# Altium schematic sheet can-interface.SchDoc
size A
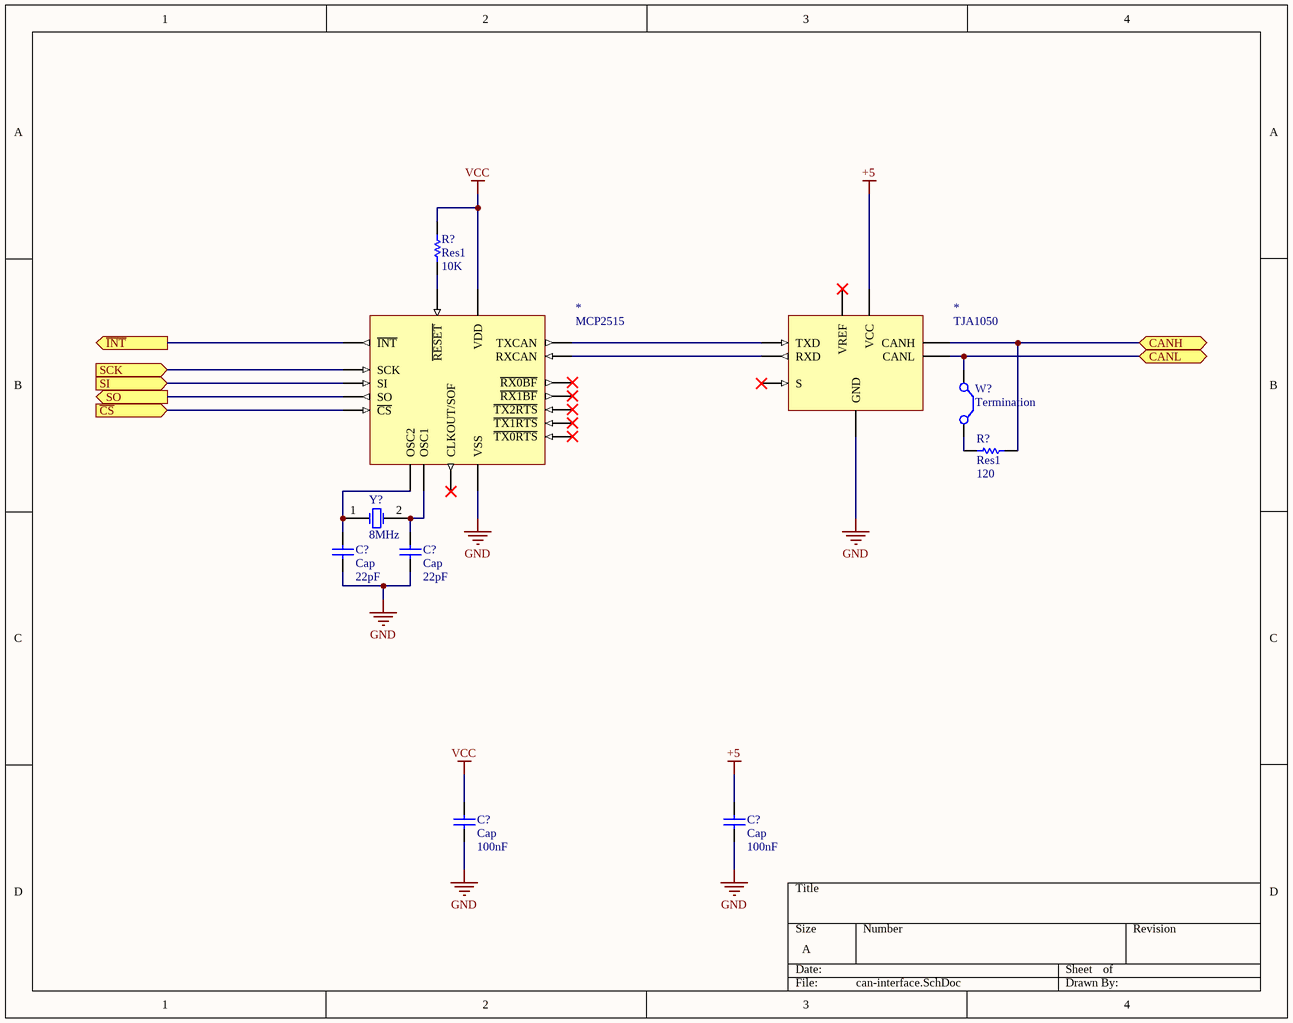
[diagram p0: can-interface.SchDoc]

## Parts
(Parts that share a designator on the sheet are numbered #1, #2 ... from top to bottom, then left to right.)
*#1  MCP2515
*#2  TJA1050
C?#1  Cap  value 22pF  [RAD-0.3]
C?#2  Cap  value 22pF  [RAD-0.3]
C?#3  Cap  value 100nF  [RAD-0.3]
C?#4  Cap  value 100nF  [RAD-0.3]
R?#1  Res1  value 10K  [AXIAL-0.3]
R?#2  Res1  value 120  [AXIAL-0.3]
W?  Termination  [RAD-0.2]
Y?  8MHz  [R38]

## Ports
CANH (bidir), CANL (bidir), SCK (in), SI (in), SO (out), ~{CS} (in), ~{INT} (out)

## Nets
+5: *#2.3(VCC) C?#4.2
GND: *#1.9(VSS) *#2.2(GND) C?#1.1 C?#2.1 C?#3.1 C?#4.1
VCC: *#1.18(VDD) C?#3.2 R?#1.2
~{CS}: *#1.16(~{CS}) ; port ~{CS}
CANH: *#2.7(CANH) R?#2.2 ; port CANH
CANL: *#2.6(CANL) W?.1(C1) ; port CANL
~{INT}: *#1.12(~{INT}) ; port ~{INT}
SCK: *#1.13(SCK) ; port SCK
SI: *#1.14(SI) ; port SI
SO: *#1.15(SO) ; port SO
Net*#1_1: *#1.1(TXCAN) *#2.1(TXD)
Net*#1_2: *#1.2(RXCAN) *#2.4(RXD)
Net*#1_7: *#1.7(OSC2) C?#1.2 Y?.1(OSC1)
Net*#1_8: *#1.8(OSC1) C?#2.2 Y?.2(OSC2)
Net*#1_17: *#1.17(~{RESET}) R?#1.1
NetR?#2_1: R?#2.1 W?.2(C2)

Not connected (* = marked no-connect by the designer): *#1 3(CLKOUT/SOF)* 4(~{TX0RTS})* 5(~{TX1RTS})* 6(~{TX2RTS})* 10(~{RX1BF})* 11(~{RX0BF})*; *#2 5(VREF)* 8(S)*

## Library data of the parts
C?#1-C?#4 = Cap: Capacitor; Published: 8-Jun-2000; LatestRevisionDate: 17-Jul-2002; LatestRevisionNote: Re-released for DXP Platform.; PackageReference: RAD-0.3; Publisher: Altium Limited; PackageDescription: Radial Cap, Thru-Hole; 2 Leads; 0.3 in Pin Spacing
R?#1 R?#2 = Res1: Resistor; Published: 8-Jun-2000; LatestRevisionDate: 17-Jul-2002; LatestRevisionNote: Re-released for DXP Platform.; PackageReference: AXIAL-0.3; Publisher: Altium Limited; PackageDescription: Axial Device, Thru-Hole; 2 Leads; 0.3 in Pin Spacing
W? = Jumper: Jumper Wire; Published: 24-Mar-1999; LatestRevisionDate: 17-Jul-2002; LatestRevisionNote: Re-released for DXP Platform.; PackageReference: RAD-0.2; Publisher: Altium Limited; PackageDescription: Radial Cap, Thru-Hole; 2 Leads; 0.2 in Pin Spacing
Y? = XTAL: Crystal Oscillator; Published: 8-Jun-2000; LatestRevisionDate: 17-Jul-2002; LatestRevisionNote: Re-released for DXP Platform.; PackageReference: R38; Publisher: Altium Limited; PackageDescription: Crystal, Thru-Hole; 2 Leads; Body 3.1 x 8.2 mm (Dia.xH)